# Altium schematic sheet Sheet1.SchDoc
size A; SheetNumber: 1; SheetTotal: 1
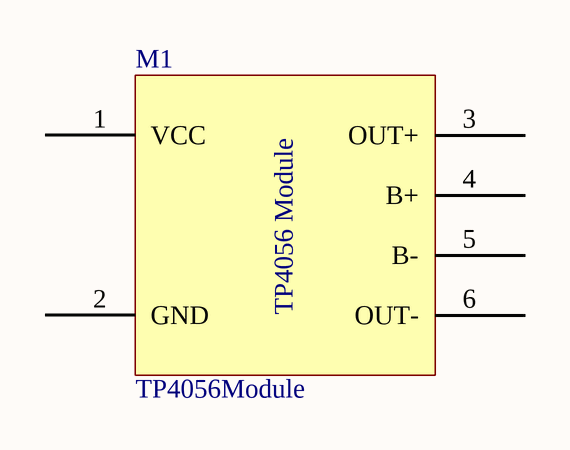
[diagram p0: Sheet1.SchDoc]

## Parts
M1  TP4056Module  [TP4056Module]

## Nets

Not connected (* = marked no-connect by the designer): M1 1(VCC) 2(GND) 3(OUT+) 4(B+) 5(B-) 6(OUT-)

## Notes on the sheet
- (in symbol TP4056Module) TP4056 Module

## Library data of the parts
M1 = TP4056Module: TP4056 Module for managing battery charging